# Altium schematic sheet OPTO_ISOLATION.SchDoc
size A4
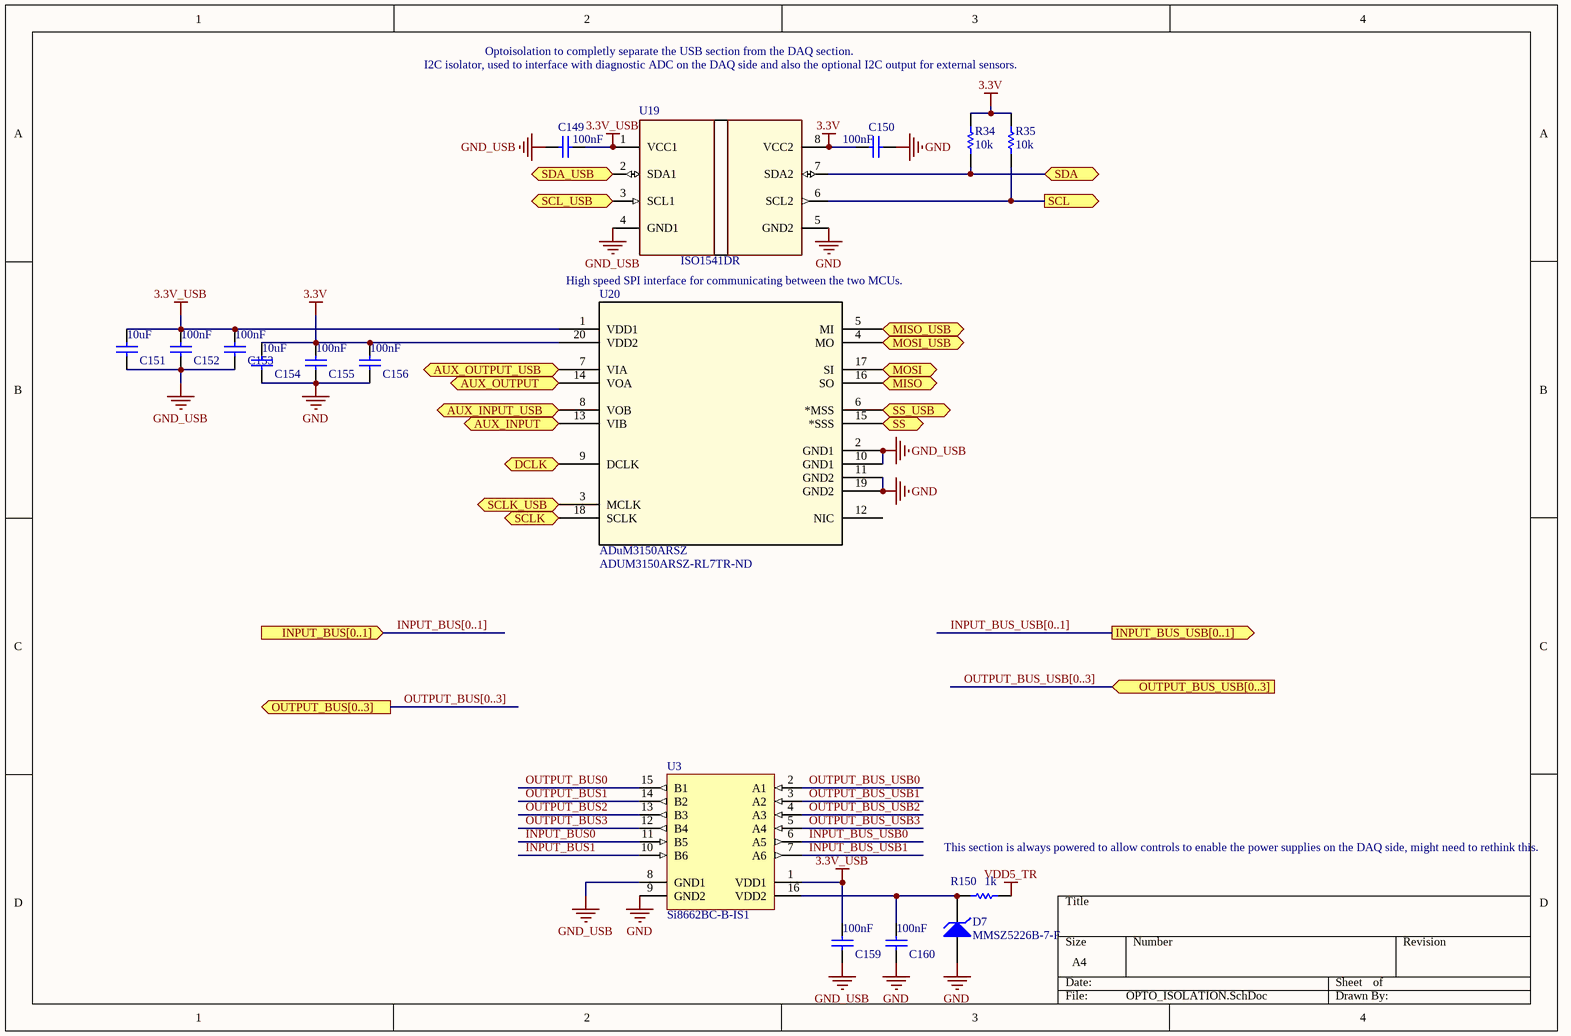
[diagram p0: OPTO_ISOLATION.SchDoc]

## Parts
C149  value 100nF  [CAPC0402(1005)60_L]  (hidden comment: CAP0402)
C150  value 100nF  [CAPC0402(1005)60_L]  (hidden comment: CAP0402)
C151  value 10uF  [CAPC0805(2012)145_L]  (hidden comment: CAP0805)
C152  value 100nF  [CAPC0402(1005)60_L]  (hidden comment: CAP0402)
C153  value 100nF  [CAPC0402(1005)60_L]  (hidden comment: CAP0402)
C154  value 10uF  [CAPC0805(2012)145_L]  (hidden comment: CAP0805)
C155  value 100nF  [CAPC0402(1005)60_L]  (hidden comment: CAP0402)
C156  value 100nF  [CAPC0402(1005)60_L]  (hidden comment: CAP0402)
C159  value 100nF  [CAPC0402(1005)60_L]  (hidden comment: CAP0402)
C160  value 100nF  [CAPC0402(1005)60_L]  (hidden comment: CAP0402)
D7  MMSZ5226B-7-F  [DIOD-SOD-123-2-A_V]
R34  value 10k  [RESC0402(1005)_L]  (hidden comment: RES0402)
R35  value 10k  [RESC0402(1005)_L]  (hidden comment: RES0402)
R150  value 1k  [RESC0603(1608)_L]  (hidden comment: RES0603)
U3  Si8662BC-B-IS1  [SLAB-SOIC-16-NB_N]
U19  ISO1541DR  [D0008A_N]
U20  ADuM3150ARSZ  Supplier Part Number 1: ADUM3150ARSZ-RL7TR-ND  [RS_20]

## Ports
AUX_INPUT (in), AUX_INPUT_USB (out), AUX_OUTPUT (out), AUX_OUTPUT_USB (in), DCLK (out), INPUT_BUS[0..1] (in), INPUT_BUS_USB[0..1] (out), MISO (in), MISO_USB (out), MOSI (out), MOSI_USB (in), OUTPUT_BUS[0..3] (out), OUTPUT_BUS_USB[0..3] (in), SCL (out), SCL_USB (in), SCLK (out), SCLK_USB (in), SDA (bidir), SDA_USB (bidir), SS (out), SS_USB (in)

## Nets
3.3V: C150.1 C154.2 C155.1 C156.1 R34.1 R35.1 U19.8(VCC2) U20.20(VDD2)
3.3V_USB: C149.2 C151.2 C152.1 C153.1 C159.1 U3.1(VDD1) U19.1(VCC1) U20.1(VDD1)
GND: C150.2 C154.1 C155.2 C156.2 C160.2 D7.1(A) U3.9(GND2) U19.5(GND2) U20.11(GND2) U20.19(GND2)
GND_USB: C149.1 C151.1 C152.2 C153.2 C159.2 U3.8(GND1) U19.4(GND1) U20.2(GND1) U20.10(GND1)
VDD5_TR: R150.2
AUX_INPUT: U20.13(VIB) ; port AUX_INPUT
AUX_INPUT_USB: U20.8(VOB) ; port AUX_INPUT_USB
AUX_OUTPUT: U20.14(VOA) ; port AUX_OUTPUT
AUX_OUTPUT_USB: U20.7(VIA) ; port AUX_OUTPUT_USB
DCLK: U20.9(DCLK) ; port DCLK
INPUT_BUS0: U3.11(B5)
INPUT_BUS1: U3.10(B6)
INPUT_BUS_USB0: U3.6(A5)
INPUT_BUS_USB1: U3.7(A6)
MISO: U20.16(SO) ; port MISO
MISO_USB: U20.5(MI) ; port MISO_USB
MOSI: U20.17(SI) ; port MOSI
MOSI_USB: U20.4(MO) ; port MOSI_USB
OUTPUT_BUS0: U3.15(B1)
OUTPUT_BUS1: U3.14(B2)
OUTPUT_BUS2: U3.13(B3)
OUTPUT_BUS3: U3.12(B4)
OUTPUT_BUS_USB0: U3.2(A1)
OUTPUT_BUS_USB1: U3.3(A2)
OUTPUT_BUS_USB2: U3.4(A3)
OUTPUT_BUS_USB3: U3.5(A4)
SCL: R35.2 U19.6(SCL2) ; port SCL
SCL_USB: U19.3(SCL1) ; port SCL_USB
SCLK: U20.18(SCLK) ; port SCLK
SCLK_USB: U20.3(MCLK) ; port SCLK_USB
SDA: R34.2 U19.7(SDA2) ; port SDA
SDA_USB: U19.2(SDA1) ; port SDA_USB
SS: U20.15(*SSS) ; port SS
SS_USB: U20.6(*MSS) ; port SS_USB
NetC160_1: C160.1 D7.2(K) R150.1 U3.16(VDD2)

Not connected (* = marked no-connect by the designer): U20 12(NIC)

## Buses and harness runs
bus INPUT_BUS[0..1] = port INPUT_BUS[0..1]
bus INPUT_BUS_USB[0..1] = port INPUT_BUS_USB[0..1]
bus OUTPUT_BUS[0..3] = port OUTPUT_BUS[0..3]
bus OUTPUT_BUS_USB[0..3] = port OUTPUT_BUS_USB[0..3]

## Notes on the sheet
- I2C isolator, used to interface with diagnostic ADC on the DAQ side and also the optional I2C output for external sensors.
- Optoisolation to completly separate the USB section from the DAQ section.
- High speed SPI interface for communicating between the two MCUs.
- (near R150) This section is always powered to allow controls to enable the power supplies on the DAQ side, might need to rethink this.

## Library data of the parts
C149 C150 C152 C153 C155 C156 C159 C160 = CMP-1590-00004-1: 0402 (1005 Metric) Chip Capacitor; Case-EIA: 0402; Case-Metric: 1005; PackageReference: CAPC0402(1005)60
C151 C154 = CMP-1590-00003-1: 0805 (2012 Metric) Chip Capacitor; Case-EIA: 0805; Case-Metric: 2012; PackageReference: CAPC0805(2012)145
D7 = CMP-2000-06742-1: Zener Diode, 500 mW, 3.3 V, -65 to 150 degC, 2-Pin SOD123, RoHS, Tape and Reel; Vf - Forward Voltage: 0.9Vat10mA; Brand: DiodesIncorporated; Configuration: Single; Unit Weight: 0.000353oz; Voltage Tolerance: 5%; Pd - Power Dissipation: 500mW; Zener Current: 25uA; Vz - Zener Voltage: 3.3V; Zz - Zener Impedance: 28Ohms; Length: 3.85mm; Manufacturer: DiodesIncorporated; Height: 1.35mm; Mounting Style: SMD/SMT; Package / Case: SOD-123-2; Termination Style: SMD/SMT; Maximum Operating Temperature: +150C; Manufacturer URL: http://www.diodes.com/; Product: ZenerDiode; Factory Pack Quantity: 3000; Product Category: ZenerDiodes; Series: MMSZ522; RoHS: True; Package Reference: SOD-123-2; Datasheet Version: Rev. 27-2, 09/2012; Datasheet URL: http://www.diodes.com/_files/datasheets/ds18010.pdf; Width: 1.7mm; Mounting Technology: SurfaceMount; Ir - Reverse Current: 25uA; Packaging: Reel; Minimum Operating Temperature: -65C; Package Description: 2-Pin Small Outline Diode, Body 2.7 x 1.55 mm
R34 R35 = CMP-1591-00004-1: 0402 (1005 Metric) Chip Resistor; Case-EIA: 0402; Case-Metric: 1005; PackageReference: RESC0402(1005)
R150 = CMP-1591-00001-1: 0603 (1608 Metric) Chip Resistor; Case-Metric: 1608; Case-EIA: 0603; PackageReference: RESC0603(1608)
U3 = CMP-0512-00153-1: Low Power Six-Channel Digital Isolator, 150 Mbps, 3.75 kVRMS Isolation Rating, -40 to 125 degC, 16-pin SOIC; Manufacturer: Silicon Labs; Enable Control: FALSE; Channel Type: Unidirectional; Isolation Rating (kV): 3.75; Maximum Propagation Delay (ns): 13; Maximum Data Rate (Mbps): 150; Sub-Family: Isolators; 10kV surge: FALSE; ComponentLink2URL: http://www.silabs.com/Support%20Documents/TechnicalDocs/Si866x.pdf; ComponentLink1URL: http://www.silabs.com/; DatasheetVersion: Rev. 1.4; ComponentLink3Description: Package Specification; ComponentLink2Description: Datasheet; ComponentLink1Description: Manufacturer URL; AEC-Q100: FALSE; PackageReference: SOIC-16-NB; PackageDescription: 16-Pin Small-Outline Integrated Circuit, Body 9.9 x 3.9 mm, Pitch 1.27 mm; Code_IPC: J-STD-020; PartNumber: Si8662BC-B-IS1; ComponentLink3URL: http://www.silabs.com/Support%20Documents/TechnicalDocs/si2401.pdf; Code_JEDEC: MS-012; Mounting Technology: Surface Mount
U19 = ISO1541DR: Imported; Manufacturer: Texas Instruments; CompType: IC; PIN_COUNT: 8; Isolated Power: No; Inputs - Side 1/Side 2: 2/1; Channel Type: Bidirectional, Unidirectional; Voltage - Isolation: 2500Vrms; Common Mode Transient Immunity (Min): 25kV/µs; Data Rate: 1Mbps; Pulse Width Distortion (Max): 80ns, 21ns; Voltage - Supply: 3 V ~ 5.5 V; PartNumber: ISO1541DR; Alternate_PartNumber: ISO1541D; PackageReference: D0008A; MountType: SMT; RoHS: Y; RefDes: RefDes; TYPE: TYPE; Value: Value; Supplier 1: Digi-Key; Manufacturer Part Number: ISO1541DR; Category: Isolators; Stock 1: 6204; Pricing 1: 1=3.62, 10=3.25, 100=2.6626, 500=2.2666, 1000=1.91159 (EUR); Packaging: Cut Tape (CT); Part Status: Active; Technology: Capacitive Coupling; Propagation Delay tpLH / tpHL (Max): -; Rise / Fall Time (Typ): -; Operating Temperature: -40°C ~ 125°C; Package / Case: 8-SOIC (0.154", 3.90mm Width); Supplier Device Package: 8-SOIC; ComponentLink1URL: http://www.ti.com/lit/ds/symlink/iso1541.pdf; ComponentLink1Description: http://www.ti.com/lit/ds/symlink/iso1541.pdf; Supplier Part Number 1: 296-34872-1-ND
U20 = ADuM3150ARSZ: Imported; Manufacturer: Analog Devices Inc.; Manufacturer Part Number: ADUM3150ARSZ-RL7; Isolated Power: No; Inputs - Side 1/Side 2: 4/2; Channel Type: Unidirectional; Voltage - Isolation: 3750Vrms; Common Mode Transient Immunity (Min): 25kV/µs; Data Rate: 40Mbps; Propagation Delay tpLH / tpHL (Max): 25ns, 25ns; Pulse Width Distortion (Max): 2ns; Rise / Fall Time (Typ): 2.5ns, 2.5ns; Voltage - Supply: 3 V ~ 5.5 V; Value: Value; Type: Type; RefDes: RefDes; Supplier 1: Digi-Key; RoHS: RoHS Compliant; Category: Isolators; Stock 1: 0; Pricing 1: 500=4.07462 (EUR); Packaging: Tape & Reel (TR); Part Status: Active; Technology: Magnetic Coupling; Operating Temperature: -40°C ~ 125°C; Package / Case: 20-SSOP (0.209", 5.30mm Width); Supplier Device Package: 20-SSOP; ComponentLink1URL: http://www.analog.com/media/en/technical-documentation/data-sheets/ADuM3150.pdf; ComponentLink1Description: http://www.analog.com/media/en/technical-documentation/data-sheets/ADuM3150.pdf